# EAGLE design EMG_FSR (EAGLE 9.6.0)
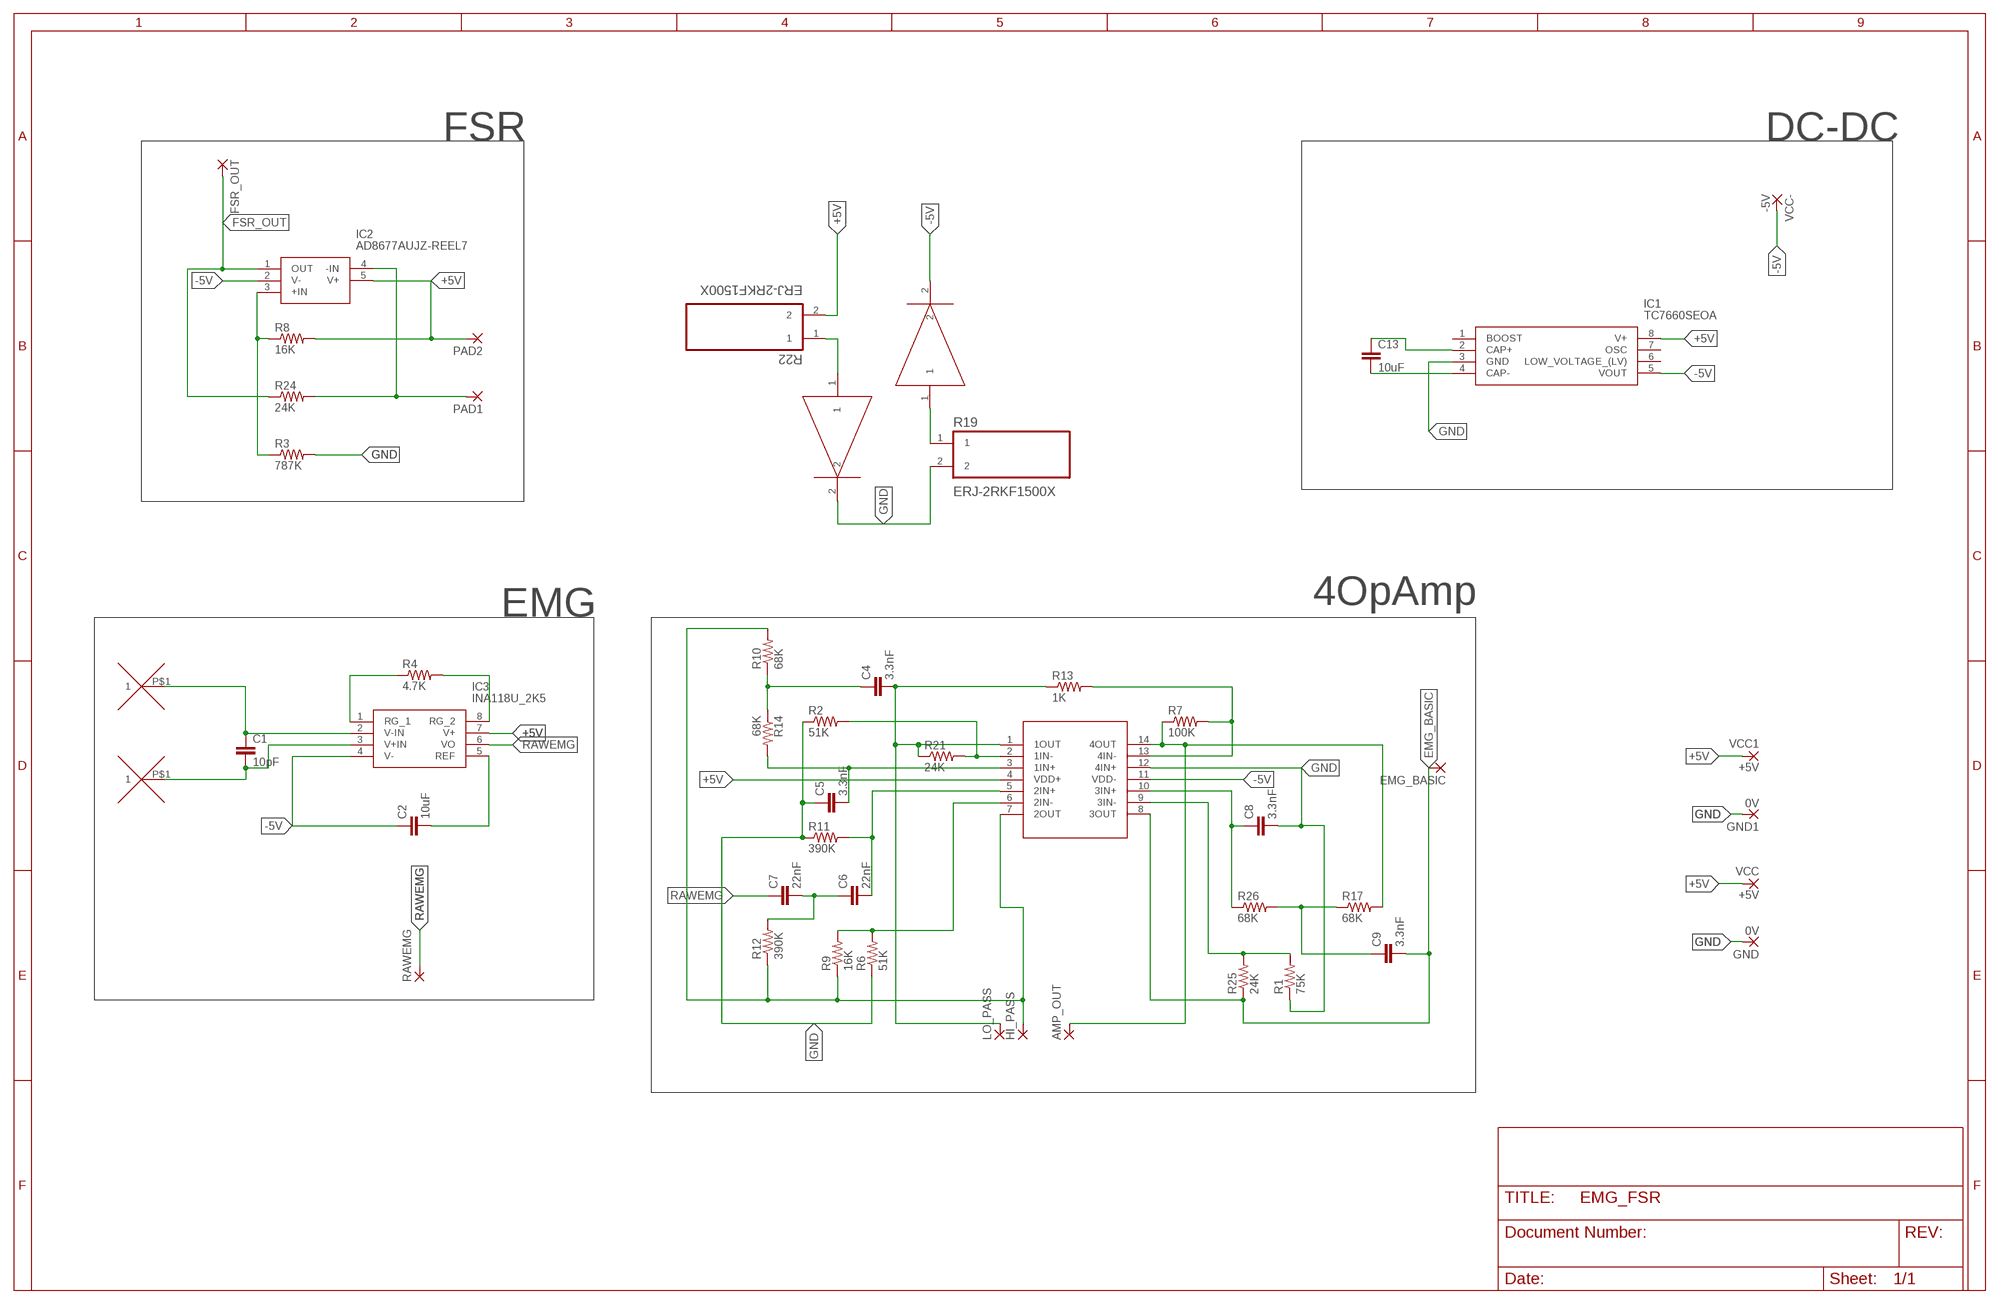
[diagram p0: schematic, sheet 1]

## Parts
AMP_OUT  1,6/0,8  [1,6/0,8]
BLUE  RESC0402X40N  [RESC0402X40N]
C1  10pF  C-EUHPC0201  [HPC0201]
C2  10uF  C-EUC0805  [C0805]
C4  3.3nF  C-EUC1206  [C1206]
C5  3.3nF  C-EUC1206  [C1206]
C6  22nF  C-EUC0805  [C0805]
C7  22nF  C-EUC0805  [C0805]
C8  3.3nF  C-EUC1206  [C1206]
C9  3.3nF  C-EUC1206  [C1206]
C13  10uF  C-EUC0805K  [C0805K]
EMG_BASIC  1,6/0,8  [1,6/0,8]
FSR_OUT  1,6/0,8  [1,6/0,8]
GND  0V  1,6/0,8  [1,6/0,8]
GND1  0V  1,6/0,8  [1,6/0,8]
HI_PASS  1,6/0,8  [1,6/0,8]
IC1  TC7660SEOA  [SOIC127P600X175-8N]
IC2  AD8677AUJZ-REEL7  [SOT95P280X100-5N]
IC3  INA118U_2K5  [SOIC127P600X175-8N]
LO_PASS  1,6/0,8  [1,6/0,8]
PAD1  SMD2  [SMD1,27-2,54]
PAD2  SMD2  [SMD1,27-2,54]
R1  75K  R-US_R0402  [R0402]
R2  51K  R-US_R0402  [R0402]
R3  787K  R-US_R0805  [R0805]
R4  4.7K  R-US_R0402  [R0402]
R6  51K  R-US_R0402  [R0402]
R7  100K  R-US_R1005  [R1005]
R8  16K  R-US_R0402  [R0402]
R9  16K  R-US_R0402  [R0402]
R10  68K  R-US_R0402  [R0402]
R11  390K  R-US_R0603  [R0603]
R12  390K  R-US_R0603  [R0603]
R13  1K  R-US_R0402  [R0402]
R14  68K  R-US_R0402  [R0402]
R17  68K  R-US_R0402  [R0402]
R19  ERJ-2RKF1500X  [RESC1005X40N]
R21  24K  R-US_R0402  [R0402]
R22  ERJ-2RKF1500X  [RESC1005X40N]
R24  24K  R-US_R0402  [R0402]
R25  24K  R-US_R0402  [R0402]
R26  68K  R-US_R0402  [R0402]
RAWEMG  1,6/0,8  [1,6/0,8]
RED  RESC0402X40N  [RESC0402X40N]
U$1  TLC2274-HT  [SOP65P640X120-14N]
U$2  EMG_VIA  [EMG_VIA]
U$3  EMG_VIA  [EMG_VIA]
VCC  +5V  1,6/0,8  [1,6/0,8]
VCC1  +5V  1,6/0,8  [1,6/0,8]
VCC-  -5V  1,6/0,8  [1,6/0,8]

## Nets
+5V: IC1.8(V+) IC2.5(V+) IC3.7(V+) PAD2.1(P) R8.2 R22.2 U$1.4(VDD+) VCC1.1(P) VCC.1(P)
-5V: BLUE.2 C2.1 IC1.5(VOUT) IC2.2(V-) IC3.4(V-) U$1.11(VDD-) VCC-.1(P)
EMG_BASIC: C9.2 EMG_BASIC.1(P) R25.1 U$1.8(3OUT)
FSR_OUT: FSR_OUT.1(P) IC2.1(OUT) R24.1
GND: C5.1 C8.2 GND1.1(P) GND.1(P) IC1.3(GND) R1.1 R2.1 R3.2 R6.1 R11.1 R19.2 RED.2 U$1.12(4IN+)
N$1: C13.1 IC1.2(CAP+)
N$2: C13.2 IC1.4(CAP-)
N$3: C1.1 IC3.2(V-IN) U$2.P$1
N$4: R22.1 RED.1
N$5: C1.2 IC3.3(V+IN) U$3.P$1
N$6: BLUE.1 R19.1
N$7: IC2.4(-IN) PAD1.1(P) R24.2
N$10: IC2.3(+IN) R3.1 R8.1
N$11: C2.2 IC3.5(REF)
N$12: IC3.1(RG_1) R4.1
N$13: IC3.8(RG_2) R4.2
N$14: C4.2 LO_PASS.1(P) R13.1 R21.1 U$1.1(1OUT)
N$17: AMP_OUT.1(P) R7.1 R17.2 U$1.14(4OUT)
N$18: R7.2 R13.2 U$1.13(4IN-)
N$19: R2.2 R21.2 U$1.2(1IN-)
N$20: C5.2 R14.2 U$1.3(1IN+)
N$21: C4.1 R10.1 R14.1
N$23: C6.1 C7.2 R12.2
N$24: C6.2 R11.2 U$1.5(2IN+)
N$26: R6.2 R9.2 U$1.6(2IN-)
N$27: C9.1 R17.1 R26.2
N$28: C8.1 R26.1 U$1.10(3IN+)
N$30: R1.2 R25.2 U$1.9(3IN-)
PIN7: HI_PASS.1(P) R9.1 R10.2 R12.1 U$1.7(2OUT)
RAWEMG: C7.1 IC3.6(VO) RAWEMG.1(P)
Unconnected: IC1.1(BOOST) IC1.6(LOW_VOLTAGE_(LV)) IC1.7(OSC)

## Notes on the sheet
- FSR | DC-DC
- EMG | 4OpAmp

## Library data of the parts
AMP_OUT EMG_BASIC FSR_OUT GND GND1 HI_PASS LO_PASS RAWEMG VCC VCC1 VCC- = wirepad:1,6/0,8: THROUGH-HOLE PAD
BLUE RED = RESC0402X40N:RESC0402X40N; A_MAX: 0.4; A_MIN: 0.4; A_NOM: 0.4; D_MAX: 1.1; D_MIN: 0.95; D_NOM: 1.0; E_MAX: 0.55; E_MIN: 0.45; E_NOM: 0.5; L1_MAX: 0.3; L1_MIN: 0.15; L1_NOM: 0.25; L_MAX: 0.3; L_MIN: 0.15; L_NOM: 0.25; MANUFACTURER: KOA; STANDARD: IPC 7351B
C1 C2 C13 = rcl@1:C-EU: CAPACITOR, European symbol; SPICEPREFIX: C
C4-C9 = rcl:C-EU: CAPACITOR, European symbol; SPICEPREFIX: C
IC1 = TC7660SEOA:TC7660SEOA: DC-TO-DC VOLTAGE CONVERTER Source: Datasheet <http://componentsearchengine.com/Datasheets/1/TC7660SEOA.pdf>; ARROW_PART_NUMBER: TC7660SEOA; ARROW_PRICE-STOCK: https://www.arrow.com/en/products/tc7660seoa/microchip-technology; DESCRIPTION: DC-TO-DC VOLTAGE CONVERTER; HEIGHT: 1.75mm; MANUFACTURER_NAME: Microchip; MANUFACTURER_PART_NUMBER: TC7660SEOA; MOUSER_PART_NUMBER: 579-TC7660SEOA; MOUSER_PRICE-STOCK: https://www.mouser.co.uk/ProductDetail/Microchip-Technology/TC7660SEOA?qs=cQYLKLPzRJl3hJI5k2EAHg%3D%3D
IC2 = AD8677AUJZ-REEL7:AD8677AUJZ-REEL7: Precision Amplifiers 130uV Max Offset VTG Source: Datasheet <http://www.analog.com/media/en/technical-documentation/data-sheets/AD8677.pdf>; ARROW_PART_NUMBER: AD8677AUJZ-REEL7; ARROW_PRICE-STOCK: https://www.arrow.com/en/products/ad8677aujz-reel7/analog-devices; DESCRIPTION: Precision Amplifiers 130uV Max Offset VTG; HEIGHT: 1mm; MANUFACTURER_NAME: Analog Devices; MANUFACTURER_PART_NUMBER: AD8677AUJZ-REEL7; MOUSER_PART_NUMBER: 584-AD8677AUJZ-R7; MOUSER_PRICE-STOCK: https://www.mouser.co.uk/ProductDetail/Analog-Devices/AD8677AUJZ-REEL7?qs=%2FtpEQrCGXCxIKHu%2FfOAijA%3D%3D
IC3 = INA118U_2K5:INA118U_2K5: Precision, Low Power Instrumentation Amplifier Source: Datasheet <http://www.ti.com/lit/gpn/INA118>; ARROW_PART_NUMBER: INA118U/2K5; ARROW_PRICE-STOCK: https://www.arrow.com/en/products/ina118u2k5/texas-instruments; DESCRIPTION: Precision, Low Power Instrumentation Amplifier; HEIGHT: 1.75mm; MANUFACTURER_NAME: Texas Instruments; MANUFACTURER_PART_NUMBER: INA118U/2K5; MOUSER_PART_NUMBER: 595-INA118U/2K5; MOUSER_PRICE-STOCK: https://www.mouser.co.uk/ProductDetail/Texas-Instruments/INA118U-2K5?qs=VBduBm9rCJRVtE6eJbSA%2Fg%3D%3D
PAD1 PAD2 = wirepad:SMD2: SMD PAD
R1 R2 R6 R8-R10 R13 R14 R17 R21 R24-R26 = adafruit@2:R-US_: RESISTOR, American symbol
R3 = rcl:R-US_: RESISTOR, American symbol; SPICEPREFIX: R
R4 R7 R12 = adafruit@1:R-US_: RESISTOR, American symbol
R11 = adafruit:R-US_: RESISTOR, American symbol
R19 R22 = ERJ-2RKF1500X:ERJ-2RKF1500X; DESCRIPTION: 150 Ohms ±1% 0.1W, 1/10W Chip Resistor 0402 (1005 Metric) Automotive AEC-Q200 Thick Film; DIGI-KEY_PART_NUMBER: P150LCT-ND; MF: Panasonic Electronic; MP: ERJ-2RKF1500X; PACKAGE: 1005 Panasonic Electronic Components; PURCHASE-URL: https://pricing.snapeda.com/search/part/ERJ-2RKF1500X/?ref=eda
U$1 = TLC2274-HT:TLC2274-HT
U$2 U$3 = EMG_VIA:EMG_VIA

## Board
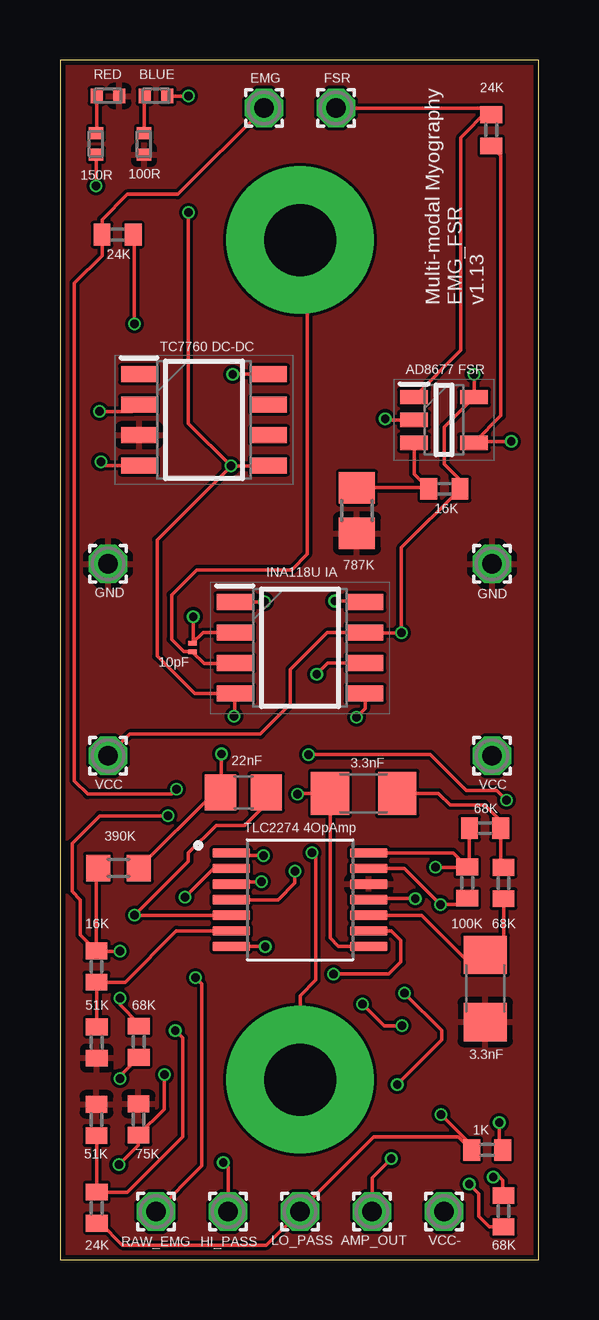
[diagram p1: board, top side]
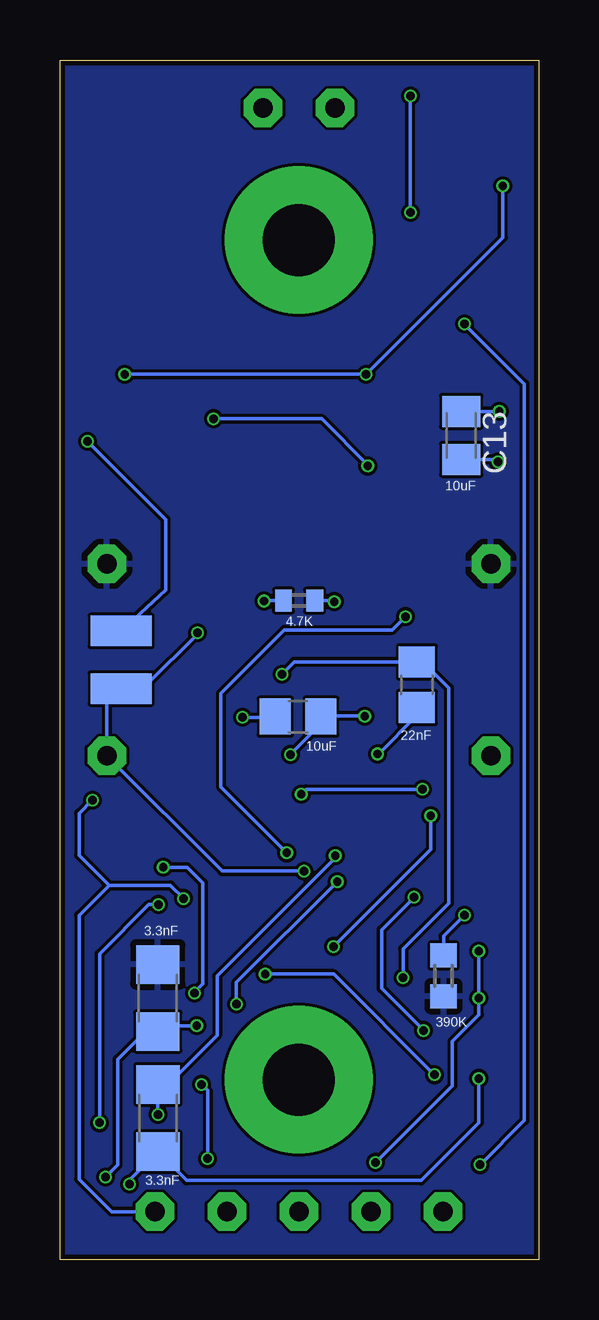
[diagram p2: board, bottom side, seen from below]

Size 19.95 x 50 mm. Coordinates in mm from the lower left corner, seen from the top.
Outline: 0,0 19.95,0 19.95,50 0,50 0,0
Copper layers (1*16): Top 0.035559375mm / dielectric 1.6mm / Bottom 0.035559375mm
Design rules "jlcpcb2layer": minimum track width 5mil, minimum drill 12mil, track to track 5mil, track to pad 5mil, pad to pad 5mil, via to via 5mil, smd to smd 5mil, copper to edge 8mil, drill to drill 6mil, minimum pad ring 5mil, minimum via ring 3mil, stop-mask expansion 2.5mil, vias tented up to drill 0mil, thermal gap 10mil

### Footprints (pad centres in the part's own frame; a part is rotated, then mirrored left to right if it is on the bottom)
1,6/0,8 = drill 0.813 pad 1.6 octagon: 1 0,0
RESC0402X40N = smd 0.51 x 0.6: 1 -0.465,0; 2 0.465,0
HPC0201 = smd 0.2 x 0.35: 1 -0.18,0; 2 0.18,0
C0805 = smd 1.3 x 1.5: 1 -0.95,0; 2 0.95,0
C1206 = smd 1.6 x 1.8: 1 -1.4,0; 2 1.4,0
C0805K = smd 1.3 x 1.6: 1 -1,0; 2 1,0
SOIC127P600X175-8N = smd 1.5 x 0.65: 1 -2.7,1.905; 2 -2.7,0.635; 3 -2.7,-0.635; 4 -2.7,-1.905; 5 2.7,-1.905; 6 2.7,-0.635; 7 2.7,0.635; 8 2.7,1.905
SOT95P280X100-5N = smd 1.15 x 0.6: 1 -1.25,0.95; 2 -1.25,0; 3 -1.25,-0.95; 4 1.25,-0.95; 5 1.25,0.95
SOIC127P600X175-8N' = smd 1.528 x 0.65: 1 -2.711,1.905; 2 -2.711,0.635; 3 -2.711,-0.635; 4 -2.711,-1.905; 5 2.711,-1.905; 6 2.711,-0.635; 7 2.711,0.635; 8 2.711,1.905
SMD1,27-2,54 = smd 1.27 x 2.54: 1 0,0
R0402 = smd 0.7 x 0.9: 1 -0.65,0; 2 0.65,0
R0805 = smd 1.3 x 1.5: 1 -0.95,0; 2 0.95,0
R1005 = smd 0.7 x 0.9: 1 -0.65,0; 2 0.65,0
R0603 = smd 1 x 1.1: 1 -0.85,0; 2 0.85,0
RESC1005X40N = smd 0.51 x 0.6: 1 -0.445,0; 2 0.445,0
SOP65P640X120-14N = smd 1.57 x 0.41: 1 -2.87,1.95; 2 -2.87,1.3; 3 -2.87,0.65; 4 -2.87,0; 5 -2.87,-0.65; 6 -2.87,-1.3; 7 -2.87,-1.95; 8 2.87,-1.95; 9 2.87,-1.3; 10 2.87,-0.65; 11 2.87,0; 12 2.87,0.65; 13 2.87,1.3; 14 2.87,1.95
EMG_VIA = drill 3 pad 6.15: P$1 0,0

### Placement (x,y rotation side)
AMP_OUT  13,2 0 top
BLUE  4,48.5 0 top
C1  5.52,25.51 270 top
C2  10.03,22.63 180 bottom
C4  15.87,5.9 90 bottom
C5  15.88,10.9 270 bottom
C6  7.64,19.47 0 top
C7  5.08,23.96 270 bottom
C8  17.72,11.3 270 top
C9  12.65,19.43 180 top
C13  3.23,34.35 270 bottom
EMG_BASIC  8.5,48 0 top
FSR_OUT  11.5,48 0 top
GND  2,29 0 top
GND1  18,29 0 top
HI_PASS  7,2 0 top
IC1  6,35 0 top
IC2  16,35 0 top
IC3  INA118U_2K5  [SOIC127P600X175-8N']  10,25.5 0 top
LO_PASS  10,2 0 top
PAD1  17.4,26.2 270 bottom
PAD2  17.4,23.8 90 bottom
R1  3.27,5.84 270 top
R2  1.52,5.82 270 top
R3  12.37,31.22 270 top
R4  9.99,27.47 180 bottom
R6  1.53,9.05 90 top
R7  16.97,15.71 270 top
R8  16.02,32.12 0 top
R9  1.52,12.21 270 top
R10  3.28,9.08 90 top
R11  3.97,11.82 90 bottom
R12  2.44,16.32 0 top
R13  17.8,4.57 0 top
R14  18.48,2.02 90 top
R17  17.71,17.98 180 top
R19  3.5,46.5 270 top
R21  1.53,2.16 90 top
R22  1.5,46.5 270 top
R24  17.97,47.07 270 top
R25  2.4,42.72 0 top
R26  18.48,15.69 90 top
RAWEMG  4,2 0 top
RED  2,48.5 0 top
U$1  10,15 0 top
U$2  10,7.5 0 top
U$3  10,42.5 0 top
VCC  2,21 0 top
VCC1  18,21 0 top
VCC-  16,2 0 top

### Tracks (layer width: path | path; a pad name or v marks a point on that pad's centre or on a via)
+5V  (via drill 0.35)
  Top 0.152: v7.2,36.9 v7.21,36.91 IC1.8 | R22.2 v1.5,44.75 | v17.25,36.9 IC2.5 16,34.7 16,33.15 16.67,32.48 R8.2 14.22,29.68 v14.22,26.12 12.72,26.12 IC3.7 11.13,26.14 9.6,24.6 9.6,23.15 8.35,21.9 2.9,21.9 VCC.1 | v9.78,16.19 9.78,15.69 9.09,15 U$1.4
  Bottom 0.152: v14.22,26.12 14.2,26.1 16.35,23.95 PAD2.1 18,23.4 VCC1.1 13.19,16.19 v9.78,16.19 | v17.25,36.9 v7.2,36.9 1.5,42.6 v1.5,44.75
-5V  (via drill 0.35)
  Top 0.152: v13.55,35.05 13.6,35 IC2.2 | v7.12,33.08 8.68,33.08 IC1.5 | v7.12,33.08 5.35,34.85 v5.35,43.65 | v5.35,48.5 BLUE.2 | v14.8,15.05 12.92,15.05 U$1.11 | v7.12,33.08 4.05,30 4.05,25.15 5.61,23.59 IC3.4 7.29,22.69 v7.25,22.65 | v10.35,21.05 15.44,21.05 16.93,19.55 18.2,19.55 v18.6,19.15
  Bottom 0.152: v13.55,35.05 9.05,35.05 7.1,33.1 v7.12,33.08 | v5.35,43.65 v5.35,48.5 | VCC-.1 17.8,2 19.15,3.35 19.15,14.35 17.9,15.6 | v14.8,15.05 15.35,15.6 17.9,15.6 | v7.25,22.65 9.06,22.65 C2.1 9.08,22.32 v10.35,21.05 | v18.6,19.15 19.15,18.6 19.15,16.85 17.9,15.6
EMG_BASIC  (via drill 0.35)
  Top 0.152: U$1.8 11.6,13.05 11.25,13.4 C9.2 9.93,19.43 v9.9,19.4 | EMG_BASIC.1 4.9,44.4 2.8,44.4 1.75,43.35 R25.1 1.75,41.85 0.6,40.7 0.6,19.95 1.15,19.4 4.65,19.4 v4.85,19.6
  Bottom 0.152: v9.9,19.4 9.7,19.6 v4.85,19.6
FSR_OUT
  Top 0.152: R24.1 18.05,47.72 17.85,47.92 | IC2.1 16.7,37.9 16.7,46.77 17.85,47.92 | FSR_OUT.1 17.77,48 17.85,47.92
GND
  pour Top: 0,50 19.95,50 19.95,0 0,0
  pour Bottom: 0,50 19.95,50 19.95,0 0,0
N$1  (via drill 0.35)
  Top 0.152: IC1.2 3.02,35.35 v1.65,35.35
  Bottom 0.152: v1.65,35.35 C13.1
N$2  (via drill 0.35)
  Top 0.152: IC1.4 1.85,33.09 v1.7,33.25
  Bottom 0.152: v1.7,33.25 1.8,33.35 C13.2
N$3  (via drill 0.35)
  Top 0.152: IC3.2 5.96,26.14 C1.1 5.55,25.72 v5.55,26.8 | U$2.P$1 10,11 10.65,11.65 10.65,16.95 v10.5,16.95
  Bottom 0.152: v10.5,16.95 13.25,19.7 13.25,23.6 10.6,26.25 6.1,26.25 v5.55,26.8
N$4
  Top 0.152: RED.1 1.53,46.98 R22.1
N$5
  Top 0.152: U$3.P$1 10.3,42.2 10.3,29.4 9.65,28.75 5.7,28.75 4.65,27.7 4.65,25.85 5.16,25.34 C1.2 6,24.85 7.27,24.85 IC3.3
N$6
  Top 0.152: R19.1 3.5,48.47 BLUE.1
N$7  (via drill 0.35)
  Top 0.152: R24.2 18.37,46.02 18.37,35.17 17.3,34.1 | 17.3,34.1 IC2.4 | v18.8,34.1 17.3,34.1
  Bottom 0.152: PAD1.1 15.55,27.9 15.55,30.85 v18.8,34.1
N$10
  Top 0.152: R3.1 15.32,32.17 R8.1 14.75,32.74 IC2.3
N$11  (via drill 0.35)
  Top 0.152: IC3.5 12.71,22.96 v12.35,22.6
  Bottom 0.152: v12.35,22.6 11.01,22.6 C2.2
N$12  (via drill 0.35)
  Top 0.152: IC3.1 8.49,27.41 8.5,27.4 v8.53,27.43
  Bottom 0.152: v8.53,27.43 8.57,27.47 R4.1
N$13  (via drill 0.35)
  Top 0.152: v11.45,27.45 12.67,27.45 IC3.8
  Bottom 0.152: R4.2 11.33,27.47 11.35,27.45 v11.45,27.45
N$14  (via drill 0.35)
  Top 0.152: v8.48,16.84 7.24,16.84 U$1.1 | R21.1 1.69,1.51 2.6,0.6 8.6,0.6 LO_PASS.1 10,2.05 13.07,5.12 16.6,5.12 R13.1 17.15,4.77 v15.87,6.05
  Bottom 0.152: v8.48,16.84 8.48,16.74 13.4,11.82 13.4,9.35 15.45,7.3 15.85,7.3 | 15.85,7.3 C4.2 | v15.87,6.05 15.87,7.28 15.85,7.3
N$17  (via drill 0.35)
  Top 0.152: R7.1 16.38,16.95 U$1.14 | R17.2 17.06,16.45 R7.1 | AMP_OUT.1 13,3.4 v13.8,4.2 | v14.05,7.3 15.9,9.15 15.9,9.55 v14.35,11.1 | R7.1 v15.65,16.35
  Bottom 0.152: v13.8,4.2 13.8,7.05 v14.05,7.3 | v15.65,16.35 14.65,16.35 14,15.7 14,11.5 14.35,11.15 v14.35,11.1
N$18  (via drill 0.35)
  Top 0.152: R7.2 16.71,14.8 v15.85,14.8 14.35,16.3 U$1.13 | v18.3,5.7 18.3,4.72 R13.2
  Bottom 0.152: v18.3,5.7 18.3,12.75 16.25,14.8 v15.85,14.8
N$19  (via drill 0.35)
  Top 0.152: R2.2 R21.2 2.81,2.81 5.12,5.12 5.12,9.23 v4.8,9.55 | v5.2,15.1 6.4,16.3 U$1.2
  Bottom 0.152: v4.8,9.55 6.55,11.3 6.55,13.75 v5.2,15.1
N$20  (via drill 0.35)
  Top 0.152: R14.2 18.45,2.7 18.45,3.3 18.31,3.44 v18.05,3.44 | v8.4,15.75 7.23,15.75 U$1.3 | v14.25,9.75 13.5,9.75 v12.6,10.65
  Bottom 0.152: v18.05,3.44 17.55,3.94 17.55,8.35 16.4,9.5 C5.2 15.63,9.75 v14.25,9.75 | v12.6,10.65 12.6,11.55 v8.4,15.75
N$21  (via drill 0.35)
  Top 0.152: v17.05,3.15 17.45,2.75 17.45,1.8 17.88,1.37 R14.1 | v2.5,7.55 2.5,7.65 R10.1
  Bottom 0.152: v2.5,7.55 2.5,5.7 4.9,3.3 14.67,3.3 C4.1 17.05,3.32 v17.05,3.15
N$23  (via drill 0.35)
  Top 0.152: R12.2 6.44,19.47 C6.1 6.72,19.5 v6.72,21.07
  Bottom 0.152: C7.2 5.08,22.67 6.7,21.05 v6.72,21.07
N$24  (via drill 0.35)
  Top 0.152: C6.2 8.63,19.43 8.63,19.03 7.7,18.1 6.5,18.1 5.35,16.95 5.35,16.6 v3.1,14.35 U$1.5
  Bottom 0.152: v3.1,14.35 3.97,13.48 R11.2
N$26
  Top 0.152: R6.2 R9.2 2.71,11.56 4.85,13.7 U$1.6
N$27
  Top 0.152: R26.2 18.36,16.46 R17.1 18.36,18.28 17.69,18.95 16.25,18.95 15.77,19.43 C9.1
N$28
  Top 0.152: U$1.10 15.07,14.35 16.97,12.45 17.47,12.45 C8.1 18.48,13.46 R26.1
N$30  (via drill 0.35)
  Top 0.152: v4.35,7.7 4.35,6.27 R1.2 3.27,4.77 v2.45,3.95 | v11.4,11.9 13.7,11.9 14.2,12.4 14.2,13.3 13.8,13.7 U$1.9 | R25.2 3.1,42.67 v3.1,39
  Bottom 0.152: v4.35,7.7 8.55,11.9 v11.4,11.9 | v3.1,39 0.6,36.5 0.6,5.8 v2.45,3.95
PIN7  (via drill 0.35)
  Top 0.152: R9.1 1.52,16.25 R12.1 | v2.5,10.9 2.5,10.61 3.28,9.83 R10.2 | v2.5,12.85 R9.1 | HI_PASS.1 7,3.85 v6.8,4.05 | R9.1 0.85,13.53 0.85,15 0.5,15.35 0.5,17.35 1.65,18.5 v4.5,18.5 | v8.55,13.05 U$1.7
  Bottom 0.152: v2.5,12.85 v2.5,10.9 2.5,10.2 3.6,9.1 3.6,7.25 v6.8,4.05 | v4.5,18.5 4.5,17.1 v8.55,13.05
RAWEMG  (via drill 0.35)
  Top 0.152: v5.65,11.75 5.9,11.5 5.9,3.9 RAWEMG.1 | IC3.6 11.16,24.86 v10.7,24.4
  Bottom 0.152: v10.7,24.4 10.19,24.91 C7.1 4.83,24.91 3.75,23.83 3.75,14.85 5.65,12.95 v5.65,11.75

### Text on the board
tNames: RED | BLUE | EMG | FSR | 24K | 150R | 100R | 24K | Multi-modal Myography / EMG_FSR / v1.13 | TC7760 DC-DC | AD8677 FSR | 16K | 787K | GND | INA118U IA | GND | 10pF | 22nF | VCC | 3.3nF | VCC | 68K | TLC2274 4OpAmp | 390K | 16K | 100K | 68K | 51K | 68K | 3.3nF | 1K | 51K | 75K | RAW_EMG | HI_PASS | LO_PASS | AMP_OUT | VCC- | 24K | 68K
bNames: 10uF | 4.7K | 22nF | 10uF | 3.3nF | 390K | 3.3nF